# EAGLE design Scoreboard Module 20150702 (EAGLE 6.6.0)
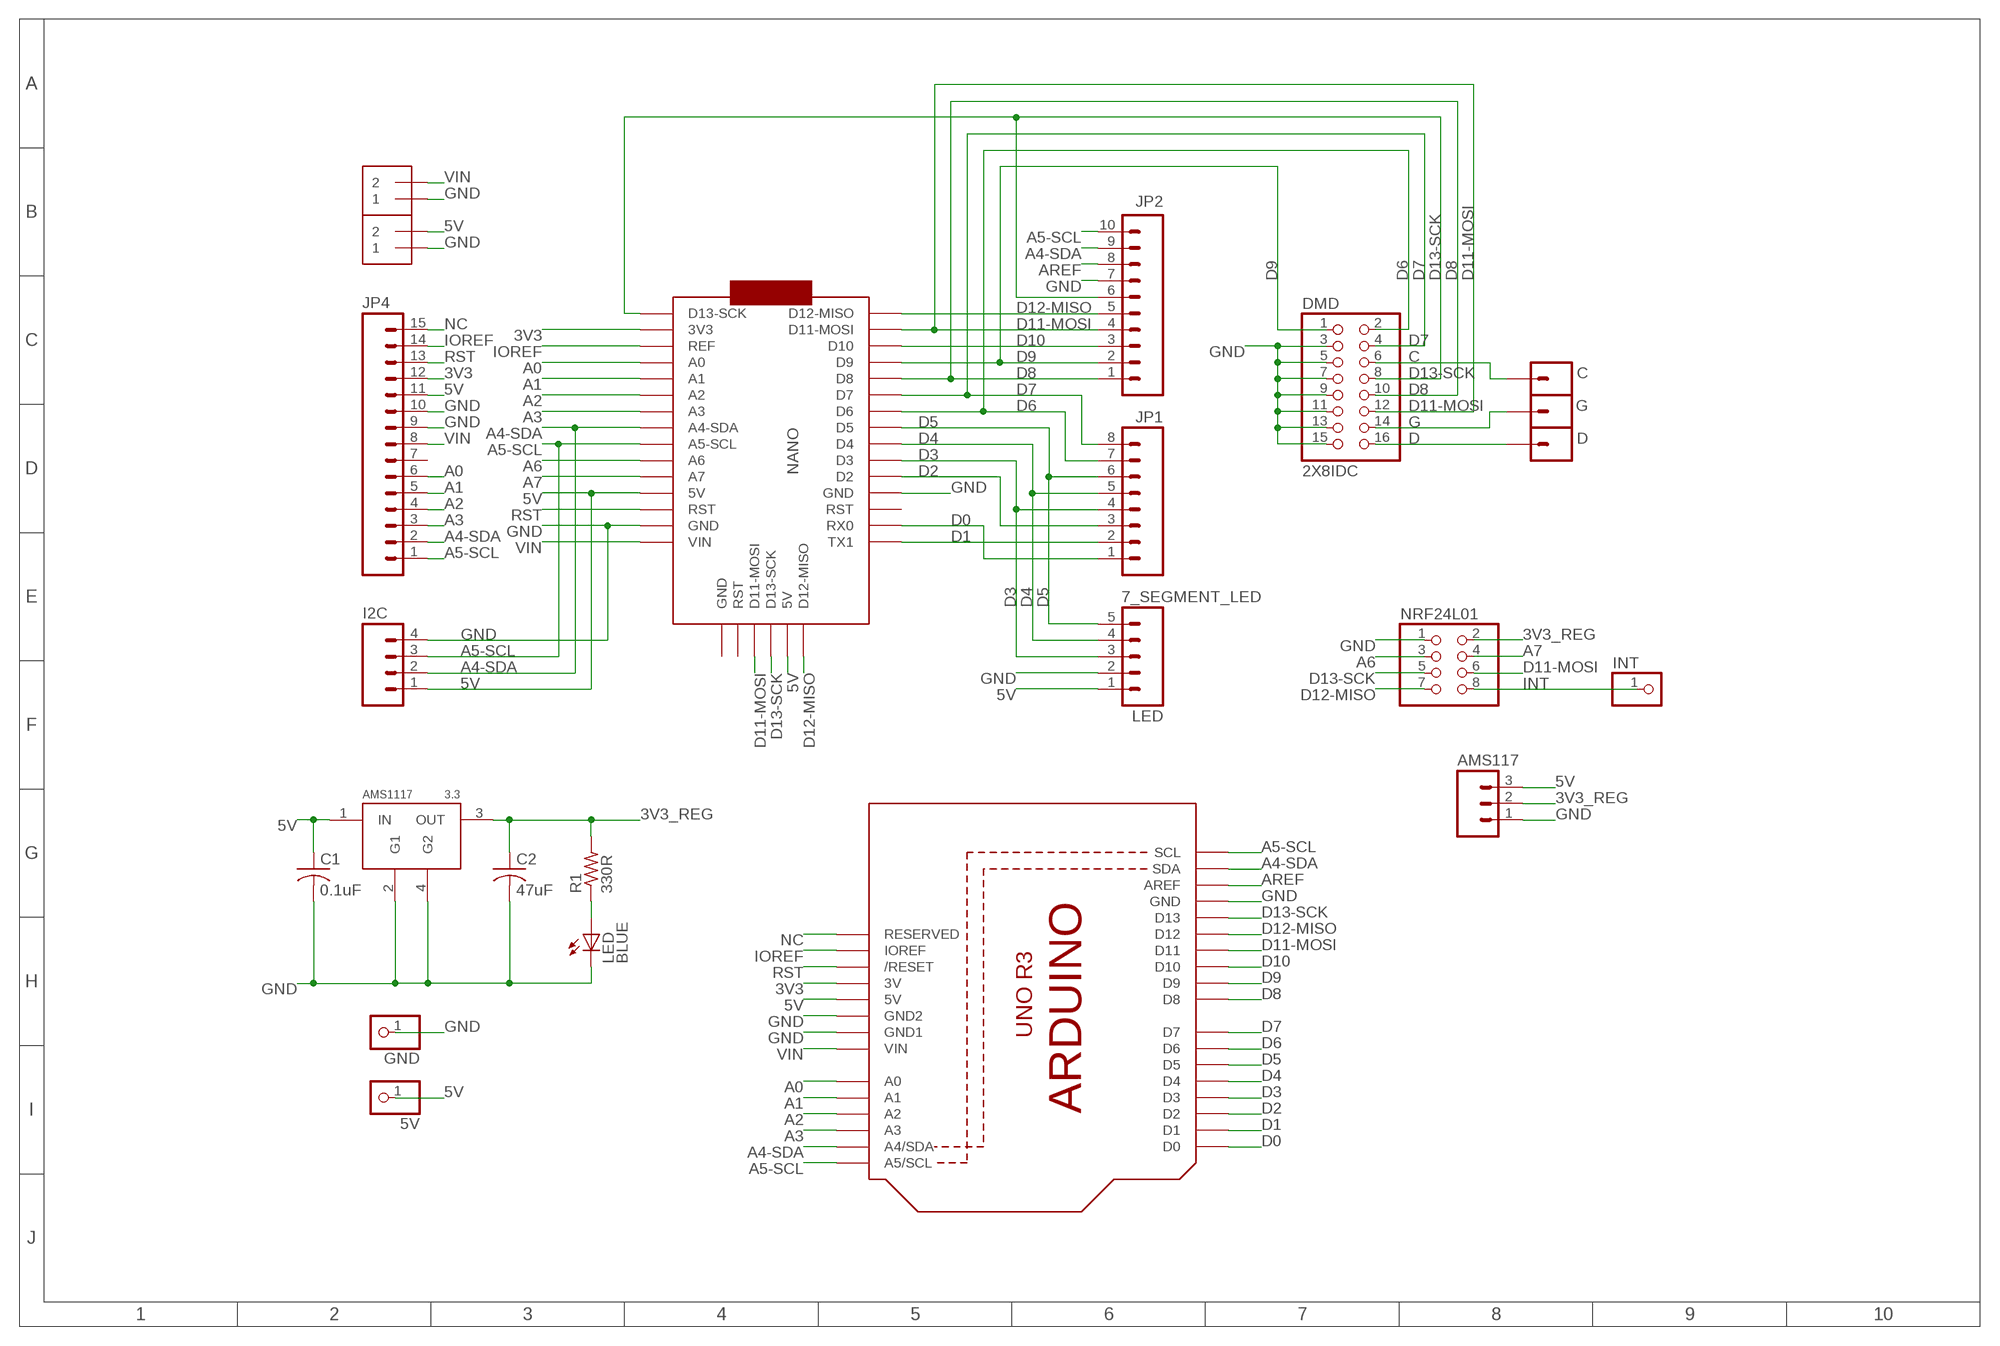
[diagram p0: schematic, sheet 1]

## Parts
5V  PINHD-1X1  [1X01]
7_SEGMENT_LED  LED  M05PTH  [1X05]
AMS117  M03PTH  [1X03]
AMS1117  3.3  VREG-SOT223  [SOT223]
C  M01PTH  [1X01]
C1  0.1uF  C-US050-035X075  [C050-035X075]
C2  47uF  C-US050-035X075  [C050-035X075]
D  M01PTH  [1X01]
DMD  2X8IDC  [2X08-IDC]
G  M01PTH  [1X01]
GND  PINHD-1X1  [1X01]
I2C  M04PTH  [1X04]
INT  PINHD-1X1  [1X01]
J1  1X2-3.5MM  [1X2-3.5MM]
J2  1X2-3.5MM  [1X2-3.5MM]
JP1  M08SILK_FEMALE_PTH  [1X08]
JP2  M10SILK_FEMALE_PTH  [1X10]
JP4  M15  [1X15]
LED  BLUE  LED3MM  [LED3MM]
NANO  ARDUINO_NANOICSP  [ARDUINO_NANO]
NRF24L01  PINHD-2X4  [2X04]
R1  330R  R-US_0204/7  [0204/7]
U2  ARDUINOR3-MOVEDTEXT  [ARDUINOR3-MOVEDTEXT]

## Nets
3V3 [power]: JP4.12 NANO.P$17(3V3) U2.3V
3V3_REG [power]: AMS117.2 AMS1117.3(OUT) C2.1 NRF24L01.2 R1.2
5V [power]: 5V.1 7_SEGMENT_LED.1 AMS117.3 AMS1117.1(IN) C1.1 I2C.1 J1.2 JP4.11 NANO.ICSP$2(5V) NANO.P$27(5V) U2.5V
A0: JP4.6 NANO.P$19(A0) U2.A0
A1: JP4.5 NANO.P$20(A1) U2.A1
A2: JP4.4 NANO.P$21(A2) U2.A2
A3: JP4.3 NANO.P$22(A3) U2.A3
A4-SDA: I2C.2 JP2.9 JP4.2 NANO.P$23(A4-SDA) U2.A4(A4/SDA) U2.SDA
A5-SCL: I2C.3 JP2.10 JP4.1 NANO.P$24(A5-SCL) U2.A5(A5/SCL) U2.SCL
A6: NANO.P$25(A6) NRF24L01.3
A7: NANO.P$26(A7) NRF24L01.4
AREF: JP2.8 U2.AREF
C: C.1 DMD.6
D: D.1 DMD.16
D0: JP1.1 NANO.P$2(RX0) U2.D0
D1: JP1.2 NANO.P$1(TX1) U2.D1
D2: JP1.3 NANO.P$5(D2) U2.D2
D3: 7_SEGMENT_LED.3 JP1.4 NANO.P$6(D3) U2.D3
D4: 7_SEGMENT_LED.4 JP1.5 NANO.P$7(D4) U2.D4
D5: 7_SEGMENT_LED.5 JP1.6 NANO.P$8(D5) U2.D5
D6: DMD.2 JP1.7 NANO.P$9(D6) U2.D6
D7: DMD.4 JP1.8 NANO.P$10(D7) U2.D7
D8: DMD.10 JP2.1 NANO.P$11(D8) U2.D8
D9: DMD.1 JP2.2 NANO.P$12(D9) U2.D9
D10: JP2.3 NANO.P$13(D10) U2.D10
D11-MOSI: DMD.12 JP2.4 NANO.ICSP$4(D11-MOSI) NANO.P$14(D11-MOSI) NRF24L01.6 U2.D11
D12-MISO: JP2.5 NANO.ICSP$1(D12-MISO) NANO.P$15(D12-MISO) NRF24L01.7 U2.D12
D13-SCK: DMD.8 JP2.6 NANO.ICSP$3(D13-SCK) NANO.P$16(D13-SCK) NRF24L01.5 U2.D13
G: DMD.14 G.1
GND [power]: 7_SEGMENT_LED.2 AMS117.1 AMS1117.2(G1) AMS1117.4(G2) C1.2 C2.2 DMD.3 DMD.5 DMD.7 DMD.9 DMD.11 DMD.13 DMD.15 GND.1 I2C.4 J1.1 J2.1 JP2.7 JP4.9 JP4.10 LED.K(C) NANO.P$4(GND) NANO.P$29(GND) NRF24L01.1 U2.GND U2.GND1 U2.GND2
INT: INT.1 NRF24L01.8
IOREF: JP4.14 NANO.P$18(REF) U2.IOREF
LED: LED.A R1.1
NC: JP4.15 U2.RESERVED
RST: JP4.13 NANO.P$28(RST) U2.RESET(/RESET)
VIN [power]: J2.2 JP4.8 NANO.P$30(VIN) U2.VIN
Unconnected: JP4.7 NANO.ICSP$5(RST) NANO.ICSP$6(GND) NANO.P$3(RST)

## Library data of the parts
5V GND INT = adafruit:PINHD-1X1: Pin header 1x1 for 0.1" spacing With round pins
7_SEGMENT_LED = SparkFun-Connectors:M05: Header 5 Standard 5-pin 0.1" header. Use with straight break away headers (SKU : PRT-00116), right angle break away headers (PRT-00553), swiss pins (PRT-00743), machine pins (PRT-00117), and female headers (PRT-00115). Molex polarized connector foot print use with SKU : PRT-08230 with associated crimp pins and housings.
AMS117 = SparkFun-Connectors:M03: Header 3 Standard 3-pin 0.1" header. Use with straight break away headers (SKU : PRT-00116), right angle break away headers (PRT-00553), swiss pins (PRT-00743), machine pins (PRT-00117), and female headers (PRT-00115). Molex polarized connector foot print use with SKU : PRT-08232 with associated crimp pins and housings.
AMS1117 = jt-vreg:VREG-SOT223: SOT223 voltage regulator
C D G = SparkFun-Connectors:M01: Header 1 Standard 1-pin 0.1" header. Use with straight break away headers (SKU : PRT-00116), right angle break away headers (PRT-00553), swiss pins (PRT-00743), machine pins (PRT-00117), and female headers (PRT-00115).
C1 C2 = adafruit:C-US: CAPACITOR, American symbol
DMD = adafruit:2X8
I2C = SparkFun-Connectors:M04: Header 4 Standard 4-pin 0.1" header. Use with straight break away headers (SKU : PRT-00116), right angle break away headers (PRT-00553), swiss pins (PRT-00743), machine pins (PRT-00117), and female headers (PRT-00115). Molex polarized connector foot print use with SKU : PRT-08231 with associated crimp pins and housings. 1MM SMD Version SKU: PRT-10208
J1 J2 = adafruit:1X2: 3.5mm Terminal block http://www.ladyada.net/library/pcb/eaglelibrary.html
JP1 = SparkFun-Connectors:M08: Header 8 Standard 8-pin 0.1" header. Use with straight break away headers (SKU : PRT-00116), right angle break away headers (PRT-00553), swiss pins (PRT-00743), machine pins (PRT-00117), and female headers (PRT-00115).; PROD_ID: CONN-08438
JP2 = SparkFun-Connectors:M10: Header 10 Standard 10-pin 0.1" header. Use with straight break away headers (SKU : PRT-00116), right angle break away headers (PRT-00553), swiss pins (PRT-00743), machine pins (PRT-00117), and female headers (PRT-00115).; PROD_ID: CONN-11563
JP4 = SparkFun-Connectors:M15: Header 15 Standard 15-pin 0.1" header. Use with straight break away headers (SKU : PRT-00116), right angle break away headers (PRT-00553), swiss pins (PRT-00743), machine pins (PRT-00117), and female headers (PRT-00115).
LED = adafruit:LED: LED OSRAM: - CHIPLED LG R971, LG N971, LY N971, LG Q971, LY Q971, LO R971, LY R971 LH N974, LH R974 LS Q976, LO Q976, LY Q976 LO Q996 - Hyper CHIPLED LW Q18S LB Q993, LB Q99A, LB R99A - SideLED LS A670, LO A670, LY A670, LG A670, LP A670 LB A673, LV A673, LT A673, LW A673 LH A674 LY A675 LS A676, LA A676, LO A676, LY A676, LW A676 LS A679, LY A679, LG A679 - Hyper Micro SIDELED® LS Y876, LA Y876, LO Y876, LY Y876 LT Y87S - SmartLED LW L88C, LW L88S LB L89C, LB L89S, LG L890 LS L89K, LO L89K, LY L89K LS L896, LA L896, LO L896, LY L896 - TOPLED LS T670, LO T670, LY T670, LG T670, LP T670 LSG T670, LSP T670, LSY T670, LOP T670, LYG T670 LG T671, LOG T671, LSG T671 LB T673, LV T673, LT T673, LW T673 LH T674 LS T676, LA T676, LO T676, LY T676, LB T676, LH T676, LSB T676, LW T676 LB T67C, LV T67C, LT T67C, LS T67K, LO T67K, LY T67K, LW E67C LS E67B, LA E67B, LO E67B, LY E67B, LB E67C, LV E67C, LT E67C LW T67C LS T679, LY T679, LG T679 LS T770, LO T770, LY T770, LG T770, LP T770 LB T773, LV T773, LT T773, LW T773 LH T774 LS E675, LA E675, LY E675, LS T675 LS T776, LA T776, LO T776, LY T776, LB T776 LHGB T686 LT T68C, LB T68C - Hyper Mini TOPLED® LB M676 - Mini TOPLED Santana® LG M470 LS M47K, LO M47K, LY M47K Source: http://www.osram.convergy.de/
NANO = Custom Parts:ARDUINO_NANO
NRF24L01 = adafruit:PINHD-2X4: PIN HEADER
R1 = adafruit:R-US_: RESISTOR, American symbol
U2 = adafruit:ARDUINOR3: This is a new object for the new Arduino R3 - with extra pins that you may want to use (such as IOref, and duplicated A4/A5

## Net classes
0 default: width 0.203 mm, clearance 0.203 mm
1 power: width 0.305 mm, clearance 0.203 mm
2 signal: width 0.203 mm, clearance 0.203 mm

## Board
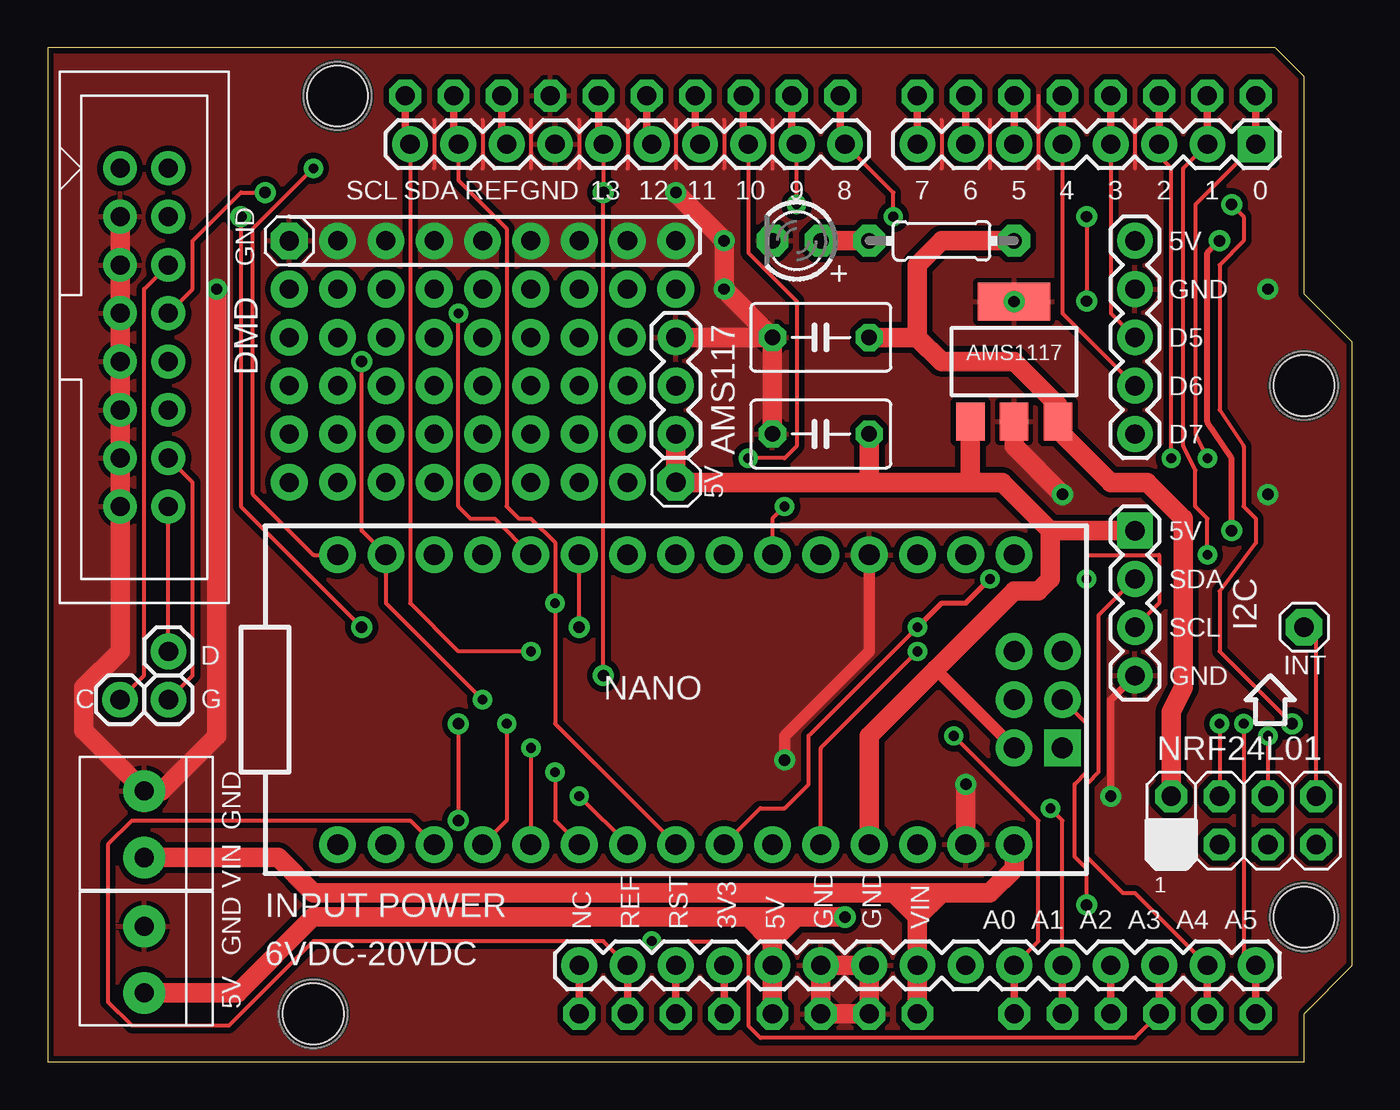
[diagram p1: board, top side]
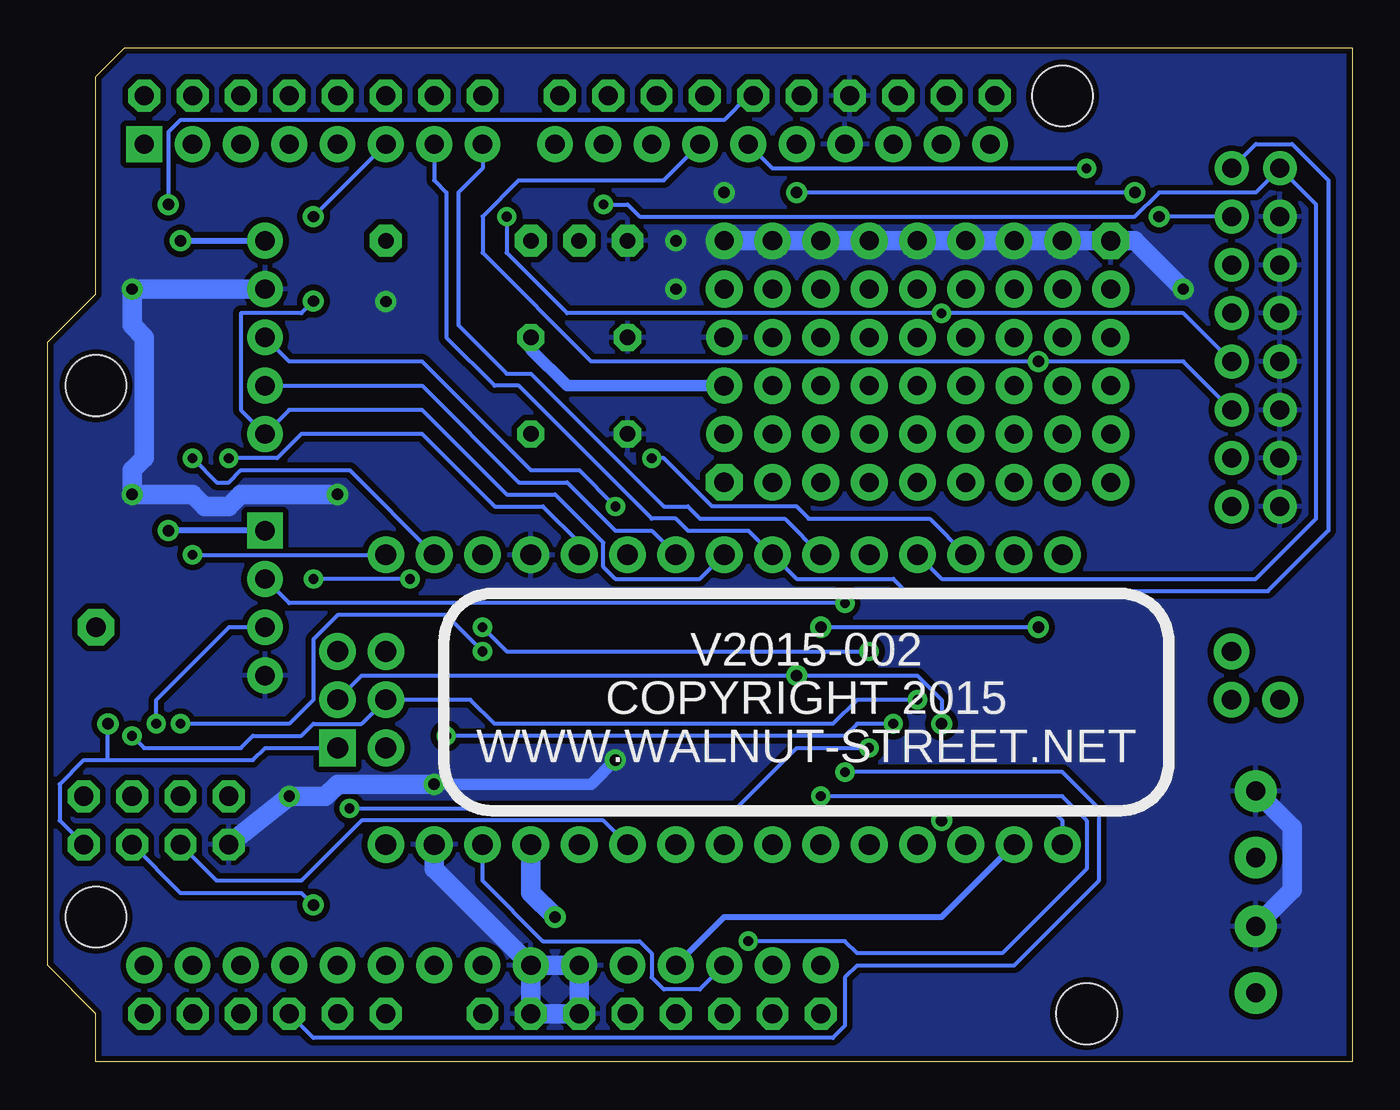
[diagram p2: board, bottom side, seen from below]

Size 68.58 x 53.34 mm. Coordinates in mm from the lower left corner, seen from the top.
Copper layers (1*16): Top 0.035mm / dielectric 1.5mm / Bottom 0.035mm
Design rules "SparkFun": minimum track width 8mil, minimum drill 20mil, track to track 8mil, track to pad 8mil, pad to pad 8mil, via to via 8mil, smd to smd 8mil, copper to edge 10mil, drill to drill 8mil, minimum pad ring 12mil, minimum via ring 10mil, stop-mask expansion 4mil, vias tented up to drill 25mil, thermal gap 10mil
Holes 3.2 mm at 15.24,50.8 66.04,35.56 66.04,7.62 13.97,2.54

### Footprints (pad centres in the part's own frame; a part is rotated, then mirrored left to right if it is on the bottom)
1X01 = drill 1.016 pad 1.93 octagon: 1 0,0
1X05 = drill 1.016 pad 1.88: 1 0,0; 2 2.54,0; 3 5.08,0; 4 7.62,0; 5 10.16,0
1X03 = drill 1.016 pad 1.88: 1 0,0; 2 2.54,0; 3 5.08,0
SOT223 = smd 1.5 x 2: 1 -2.3,-3.15; 2 0,-3.15; 3 2.3,-3.15 | smd 3.8 x 2: 4 0,3.15
1X01' = drill 1.016 pad 1.88: 1 0,0
C050-035X075 = drill 0.813 octagon: 1 -2.54,0; 2 2.54,0
2X08-IDC = drill 1 pad 1.778: 1 -1.27,8.89; 2 1.27,8.89; 3 -1.27,6.35; 4 1.27,6.35; 5 -1.27,3.81; 6 1.27,3.81; 7 -1.27,1.27; 8 1.27,1.27; 9 -1.27,-1.27; 10 1.27,-1.27; 11 -1.27,-3.81; 12 1.27,-3.81; 13 -1.27,-6.35; 14 1.27,-6.35; 15 -1.27,-8.89; 16 1.27,-8.89
1X04 = drill 1.016 pad 1.88 square: 1 0,0 | drill 1.016 pad 1.88: 2 2.54,0; 3 5.08,0; 4 7.62,0
1X2-3.5MM = drill 1 pad 2.184: 1 1.8,0; 2 -1.7,0
1X08 = drill 1.016 pad 1.88 square: 1 0,0 | drill 1.016 pad 1.88: 2 2.54,0; 3 5.08,0; 4 7.62,0; 5 10.16,0; 6 12.7,0; 7 15.24,0; 8 17.78,0
1X10 = drill 1.016 pad 1.88: 1 0,0; 2 2.54,0; 3 5.08,0; 4 7.62,0; 5 10.16,0; 6 12.7,0; 7 15.24,0; 8 17.78,0; 9 20.32,0; 10 22.86,0
1X15 = drill 1.016 pad 1.88: 1 0,0; 2 2.54,0; 3 5.08,0; 4 7.62,0; 5 10.16,0; 6 12.7,0; 7 15.24,0; 8 17.78,0; 9 20.32,0; 10 22.86,0; 11 25.4,0; 12 27.94,0; 13 30.48,0; 14 33.02,0; 15 35.56,0
LED3MM = drill 0.813 pad 1.676 octagon: A -1.27,0; K 1.27,0
ARDUINO_NANO = drill 1.1 pad 1.93 square: ICSP$1 20.32,-2.54 | drill 1.1 pad 1.93: ICSP$2 17.78,-2.54; ICSP$3 20.32,0; ICSP$4 17.78,0; ICSP$5 20.32,2.54; ICSP$6 17.78,2.54; P$1 17.78,7.62; P$2 15.24,7.62; P$3 12.7,7.62; P$4 10.16,7.62; P$5 7.62,7.62; P$6 5.08,7.62; P$7 2.54,7.62; P$8 0,7.62; P$9 -2.54,7.62; P$10 -5.08,7.62; P$11 -7.62,7.62; P$12 -10.16,7.62; P$13 -12.7,7.62; P$14 -15.24,7.62; P$15 -17.78,7.62; P$16 -17.78,-7.62; P$17 -15.24,-7.62; P$18 -12.7,-7.62; P$19 -10.16,-7.62; P$20 -7.62,-7.62; P$21 -5.08,-7.62; P$22 -2.54,-7.62; P$23 0,-7.62; P$24 2.54,-7.62; P$25 5.08,-7.62; P$26 7.62,-7.62; P$27 10.16,-7.62; P$28 12.7,-7.62; P$29 15.24,-7.62; P$30 17.78,-7.62
2X04 = drill 1.016 pad 1.676 octagon: 1 -3.81,-1.27; 2 -3.81,1.27; 3 -1.27,-1.27; 4 -1.27,1.27; 5 1.27,-1.27; 6 1.27,1.27; 7 3.81,-1.27; 8 3.81,1.27
0204/7 = drill 0.813 pad 1.676 octagon: 1 -3.81,0; 2 3.81,0
ARDUINOR3-MOVEDTEXT = drill 1 pad 1.676 octagon: 3V 35.56,2.54; 5V 38.1,2.54; A0 50.8,2.54; A1 53.34,2.54; A2 55.88,2.54; A3 58.42,2.54; A4 60.96,2.54; A5 63.5,2.54; AREF 23.876,50.8; D0 63.5,50.8; D1 60.96,50.8; D2 58.42,50.8; D3 55.88,50.8; D4 53.34,50.8; D5 50.8,50.8; D6 48.26,50.8; D7 45.72,50.8; D8 41.656,50.8; D9 39.116,50.8; D10 36.576,50.8; D11 34.036,50.8; D12 31.496,50.8; D13 28.956,50.8; GND 26.416,50.8; GND1 43.18,2.54; GND2 40.64,2.54; IOREF 30.48,2.54; RESERVED 27.94,2.54; RESET 33.02,2.54; SCL 18.796,50.8; SDA 21.336,50.8; VIN 45.72,2.54

### Placement (x,y rotation side)
5V  33.02,30.48 0 top
7_SEGMENT_LED  57.15,43.18 270 top
AMS117  33.02,38.1 270 top
AMS1117  50.8,36.83 0 top
C  M01PTH  [1X01']  3.81,19.05 0 top
C1  40.64,33.02 180 top
C2  40.64,38.1 180 top
D  M01PTH  [1X01']  6.35,21.59 0 top
DMD  5.08,38.1 0 top
G  M01PTH  [1X01']  6.35,19.05 0 top
GND  12.7,43.18 0 top
I2C  57.15,27.94 270 top
INT  66.04,22.86 0 top
J1  5.08,5.33 90 top
J2  5.08,12.45 90 top
JP1  63.5,48.26 180 top
JP2  41.91,48.26 180 top
JP4  63.5,5.08 180 top
LED  39.37,43.18 180 top
NANO  33.02,19.05 0 top
NRF24L01  62.87,12.7 0 top
R1  46.99,43.18 0 top
U2  0,0 0 top

### Tracks (layer width: path | path; a pad name or v marks a point on that pad's centre or on a via)
3V3
  Top 0.406: U2.3V JP4.12
  Bottom 0.305: NANO.P$17 21.59,7.62 33.02,7.62 JP4.12
3V3_REG
  Top 1.016: 45.72,38.1 46.99,36.83 50.8,36.83 53.1,34.53 AMS1117.3 53.1,33.26 55.88,30.48 57.78,30.48 59.69,28.57 59.69,19.68 59.05,18.41 NRF24L01.2 | 45.72,38.1 C2.1 | 45.72,38.1 45.72,41.91 46.99,43.18 R1.2
  Bottom 0.61: AMS117.2 41.27,35.56 43.18,37.47 C2.1
5V  (via drill 0.6)
  Top 0.305: v62.23,27.94 62.23,31.75 60.96,33.66 60.96,42.55 v61.59,43.18
  Top 0.61: 46.67,20.64 NANO.ICSP$2
  Top 1.016: J1.2 9.98,3.63 13.97,7.62 36.83,7.62 | 36.83,7.62 38.1,6.35 | 38.1,6.35 JP4.11 U2.5V | 36.83,7.62 39.37,7.62 | 38.1,6.35 39.37,7.62 | 39.37,7.62 v41.91,7.62 | NANO.P$27 43.18,17.14 46.67,20.64 50.8,24.77 52.07,24.77 52.7,25.4 52.7,27.94 | 48.26,30.48 50.16,30.48 52.7,27.94 | 48.26,30.48 43.18,30.48 | 43.18,30.48 5V.1 AMS117.3 | C1.1 43.18,30.48 | AMS1117.1 48.5,30.72 48.26,30.48 | I2C.1 52.7,27.94
  Bottom 0.305: v61.59,43.18 7_SEGMENT_LED.1 | I2C.1 v62.23,27.94
  Bottom 1.016: v41.91,7.62 43.18,8.89 NANO.P$27
A0  (via drill 0.51)
  Top 0.203: NANO.P$19 24.13,12.7 v24.13,17.78 | JP4.6 52.07,6.35 52.07,12.7 v47.62,17.14
  Top 0.406: U2.A0 JP4.6
  Bottom 0.203: v24.13,17.78 26.04,17.78 26.67,17.14 v47.62,17.14
A1  (via drill 0.51)
  Top 0.203: v25.4,16.51 NANO.P$20 | v52.7,13.34 53.34,12.7 JP4.5
  Top 0.406: U2.A1 JP4.5
  Bottom 0.203: v25.4,16.51 29.21,16.51 32.38,13.34 v52.7,13.34
A2  (via drill 0.51)
  Top 0.203: NANO.P$21 26.67,12.7 v26.67,15.24
  Top 0.406: U2.A2 JP4.4
  Bottom 0.203: v26.67,15.24 15.24,15.24 13.34,13.34 13.34,9.53 17.78,5.08 26.04,5.08 26.67,4.45 26.67,1.91 27.3,1.27 54.61,1.27 U2.A2
A3  (via drill 0.51)
  Top 0.203: v27.94,13.97 NANO.P$22 | U2.A3 57.15,1.27 37.47,1.27 36.83,1.91 36.83,5.71 36.2,6.35 v31.75,6.35
  Top 0.406: U2.A3 JP4.3
  Bottom 0.203: v27.94,13.97 15.24,13.97 13.97,12.7 13.97,10.16 18.41,5.71 26.04,5.71 26.67,6.35 v31.75,6.35
A4-SDA  (via drill 0.51)
  Top 0.203: I2C.2 55.24,23.5 55.24,15.24 54.61,14.61 54.61,10.79 56.52,8.89 57.15,8.89 JP4.2 | NANO.P$23 26.67,17.78 v26.67,24.13 26.67,27.3 25.4,28.57 24.77,28.57 24.13,29.21 24.13,43.81 21.59,46.35 JP2.9
  Top 0.406: U2.SDA 21.34,48.51 JP2.9 | U2.A4 JP4.2
  Bottom 0.203: I2C.2 55.88,24.13 v26.67,24.13
A5-SCL  (via drill 0.51)
  Top 0.203: NANO.P$24 37.47,13.34 38.73,13.34 40.01,14.61 40.01,17.14 v45.72,22.86 | JP4.1 62.87,5.71 v62.87,17.78 | JP2.10 19.05,24.13 21.59,21.59 v25.4,21.59 | I2C.3 58.42,24.13 58.42,26.67 54.61,26.67 v54.61,25.4
  Top 0.254: v45.72,22.86 46.99,24.13 48.26,24.13 v49.53,25.4
  Top 0.406: U2.SCL 18.8,48.51 JP2.10 | U2.A5 JP4.1
  Bottom 0.203: I2C.3 59.05,22.86 62.87,19.05 v62.87,17.78 | v25.4,21.59 44.45,21.59 v45.72,22.86 | v49.53,25.4 v54.61,25.4
A6
  Bottom 0.203: NANO.P$25 39.37,12.7 52.07,12.7 55.24,9.53 59.69,9.53 NRF24L01.3
A7  (via drill 0.51)
  Top 0.203: v61.59,17.78 NRF24L01.4 | v45.72,21.59 40.64,16.51 NANO.P$26
  Bottom 0.203: v45.72,21.59 47.62,23.5 53.34,23.5 54.61,22.23 54.61,19.05 55.88,17.78 v61.59,17.78
AREF
  Top 0.406: U2.AREF 23.88,48.51 JP2.8
C
  Top 0.203: DMD.6 5.08,40.64 5.08,20.32 C.1
D
  Top 0.203: D.1 DMD.16
D0  (via drill 0.51)
  Top 0.203: JP1.1 60.33,45.09 60.33,33.02 v60.96,31.75
  Top 0.406: U2.D0 JP1.1
  Bottom 0.203: NANO.P$2 52.7,31.11 58.42,31.11 59.05,30.48 59.69,30.48 v60.96,31.75
D1  (via drill 0.51)
  Top 0.203: JP1.2 59.69,46.99 59.69,32.38 60.33,31.11 60.33,29.21 60.96,28.57 v60.96,26.67
  Top 0.406: U2.D1 JP1.2
  Bottom 0.203: v60.96,26.67 NANO.P$1
D2  (via drill 0.51)
  Top 0.203: v59.05,31.75 59.05,46.99 58.42,47.62 JP1.3
  Top 0.406: U2.D2 JP1.3
  Bottom 0.203: NANO.P$5 40.64,27.3 42.55,29.21 45.09,29.21 48.9,33.02 55.24,33.02 56.52,31.75 v59.05,31.75
D3  (via drill 0.51)
  Top 0.203: 7_SEGMENT_LED.3 55.88,39.37 JP1.4 | v38.73,29.21 38.1,28.57 NANO.P$6
  Top 0.406: U2.D3 JP1.4
  Bottom 0.203: v38.73,29.21 40.64,31.11 43.18,31.11 48.9,36.83 55.88,36.83 7_SEGMENT_LED.3
D4
  Top 0.203: 7_SEGMENT_LED.4 53.34,39.37 JP1.5
  Top 0.406: U2.D4 JP1.5
  Bottom 0.203: NANO.P$7 36.83,27.94 38.73,27.94 41.27,30.48 43.81,30.48 48.9,35.56 7_SEGMENT_LED.4
D5  (via drill 0.6)
  Top 0.203: v54.61,44.45 v54.61,40.01
  Top 0.406: U2.D5 JP1.6
  Bottom 0.203: NANO.P$8 34.29,25.4 38.73,25.4 39.37,26.04 39.37,27.3 41.91,29.84 44.45,29.84 48.9,34.29 55.88,34.29 7_SEGMENT_LED.5 58.42,34.29 58.42,39.37 55.24,39.37 v54.61,40.01 | JP1.6 v54.61,44.45
D6
  Top 0.406: U2.D6 JP1.7
  Bottom 0.203: DMD.2 5.08,48.26 3.17,48.26 1.27,46.35 1.27,27.94 4.45,24.77 23.5,24.77 24.13,25.4 29.21,25.4 NANO.P$9 31.75,27.94 34.92,27.94 35.56,28.57 36.83,28.57 43.81,35.56 45.09,35.56 47.62,38.1 47.62,45.72 48.26,46.35 JP1.7
D7  (via drill 0.6 pad 1.02)
  Top 0.203: v10.16,44.45 10.16,29.21 v16.51,22.86 | v27.94,22.86 NANO.P$10
  Top 0.406: U2.D7 JP1.8
  Bottom 0.203: JP1.8 45.72,46.99 46.99,45.72 46.99,38.73 44.45,36.2 43.18,36.2 36.2,29.21 34.92,29.21 34.29,28.57 29.84,28.57 NANO.P$10 | DMD.4 v10.16,44.45 | v16.51,22.86 v27.94,22.86
D8  (via drill 0.51)
  Top 0.203: v21.59,39.37 21.59,29.21 22.23,28.57 23.5,28.57 NANO.P$11 | JP2.1 44.45,45.72 v44.45,44.45
  Top 0.406: U2.D8 41.66,48.51 JP2.1
  Bottom 0.203: DMD.10 8.89,39.37 v21.59,39.37 41.27,39.37 44.45,42.55 v44.45,44.45
D9  (via drill 0.51)
  Top 0.203: v39.37,45.09 JP2.2
  Top 0.406: U2.D9 39.12,48.51 JP2.2
  Bottom 0.203: NANO.P$12 21.59,25.4 5.08,25.4 1.91,28.57 1.91,45.09 DMD.1 5.08,45.72 10.16,45.72 11.43,44.45 37.47,44.45 38.1,45.09 v39.37,45.09
D10  (via drill 0.51)
  Top 0.203: JP2.3 36.83,42.55 39.37,40.01 39.37,32.38 38.73,31.75 v36.83,31.75
  Top 0.406: U2.D10 36.58,48.51 JP2.3
  Bottom 0.203: NANO.P$13 22.23,28.57 28.57,28.57 29.21,29.21 33.66,29.21 36.2,31.75 v36.83,31.75
D11-MOSI  (via drill 0.51, 0.6)
  Top 0.203: v64.14,17.14 NRF24L01.6 | v22.86,19.05 17.78,24.13 NANO.P$14 16.51,27.94 v16.51,36.83
  Top 0.406: U2.D11 34.04,48.51 JP2.4
  Bottom 0.203: DMD.12 8.89,36.83 v16.51,36.83 40.01,36.83 45.72,42.55 45.72,44.45 43.81,46.35 36.2,46.35 JP2.4 | v22.86,19.05 26.04,19.05 27.3,17.78 45.09,17.78 46.35,19.05 NANO.ICSP$4 52.07,17.78 54.61,17.78 55.24,17.14 57.78,17.14 58.42,16.51 63.5,16.51 v64.14,17.14
D12-MISO  (via drill 0.51, 0.6)
  Top 0.203: NANO.P$15 13.97,26.67 10.79,29.84 10.79,43.81 v13.97,46.99 | v62.23,45.09 62.87,44.45 62.87,43.18 61.59,41.91 61.59,34.29 62.87,32.38 62.87,29.21 63.5,28.57 63.5,27.3 61.59,24.77 61.59,21.59 v65.41,17.78
  Top 0.406: U2.D12 31.5,48.51 JP2.5
  Bottom 0.203: v13.97,46.99 30.48,46.99 JP2.5 | NRF24L01.7 67.94,12.7 67.94,14.61 66.67,15.88 65.41,15.88 | U2.D12 31.75,50.8 33.02,49.53 61.59,49.53 62.23,48.9 v62.23,45.09 | 65.41,15.88 v65.41,17.78 | 65.41,15.88 57.78,15.88 57.15,16.51 NANO.ICSP$1
D13-SCK  (via drill 0.6)
  Top 0.203: JP2.6 v29.21,45.72 v29.21,20.32 | v21.59,17.78 v21.59,12.7 | NANO.ICSP$3 54.61,17.78 54.61,15.24 53.98,14.61 53.98,10.79 54.61,10.16 v54.61,8.26 | DMD.8 7.62,40.64 7.62,43.18 10.16,45.72 v11.43,45.72
  Top 0.406: U2.D13 28.96,48.51 JP2.6
  Bottom 0.203: v21.59,17.78 21.59,19.05 22.86,20.32 v29.21,20.32 52.07,20.32 NANO.ICSP$3 | v21.59,12.7 20.95,13.34 15.88,13.34 15.24,12.7 NANO.P$16 | v11.43,45.72 v29.21,45.72 | NRF24L01.5 61.59,8.89 55.24,8.89 v54.61,8.26
G
  Top 0.203: DMD.14 7.62,30.48 7.62,20.32 G.1
GND  (via drill 0.6, 0.6 pad 1.02, 1 pad 1.93)
  Top 0.203: 38.1,49.53 38.1,46.99 | 46.99,49.53 46.99,46.99 | 49.53,49.53 49.53,46.99 | 57.15,49.53 57.15,46.99 | 30.48,49.53 30.48,46.99 | 27.94,49.53 27.94,46.99 | 33.02,49.53 33.02,46.99 | 35.56,49.53 35.56,46.99 | 20.32,49.53 20.32,46.99 | 22.86,49.53 22.86,46.99 | 25.4,49.53 25.4,46.99 | 52.07,50.8 52.07,46.99
  Top 0.406: v55.88,13.97 55.88,19.05 I2C.4
  Top 0.61: NANO.P$4 43.18,21.59 38.73,17.14 v38.73,15.88
  Top 1.016: AMS1117.4 50.83,40.01 52.07,40.01 | C2.2 C1.2 | C2.2 v35.56,40.64 v35.56,43.18 v33.02,45.72 | v8.89,40.64 8.89,17.14 5.99,14.25 J2.1 1.91,17.42 1.91,19.68 3.81,21.59 DMD.15 DMD.13 DMD.11 DMD.9 DMD.7 DMD.5 DMD.3 | NANO.P$29 v48.26,14.61 | v53.34,29.84 50.8,32.38 AMS1117.2 | AMS117.1 C2.2 | U2.GND2 JP4.10 JP4.9 U2.GND1 U2.GND2
  Bottom 0.61: v38.73,15.88 40.01,14.61 v48.26,14.61
  Bottom 1.016: JP4.9 JP4.10 U2.GND2 U2.GND1 JP4.9 | v33.02,43.18 v30.48,43.18 v27.94,43.18 v25.4,43.18 v22.86,43.18 v20.32,43.18 v17.78,43.18 v15.24,43.18 GND.1 11.43,43.18 v8.89,40.64 | JP4.9 48.26,10.16 NANO.P$29 | NRF24L01.1 v55.88,13.97 53.98,13.97 53.34,14.61 v48.26,14.61 | 7_SEGMENT_LED.2 v64.14,40.64 64.14,38.73 63.5,38.1 63.5,31.75 64.14,31.11 v64.14,29.84 60.96,29.84 60.33,29.21 59.05,29.21 58.42,29.84 v53.34,29.84 | J2.1 3.17,12.34 3.17,9.04 J1.1
  other vias: 50.8,39.98
  pour Bottom (isolate 0.305): 0,53.34 0,0 66.04,0 66.04,2.54 68.58,5.08 68.58,38.1 66.04,40.64 66.04,52.07 64.77,53.34
  pour Top (isolate 0.305): 0,0 0,53.34 64.77,53.34 66.04,52.07 66.04,40.64 68.58,38.1 68.58,5.08 66.04,2.54 66.04,0
INT
  Top 0.203: NRF24L01.8 66.67,22.23 INT.1
IOREF
  Top 0.203: NANO.P$18 19.05,12.7 4.45,12.7 3.17,11.43 3.17,3.17 4.45,1.91 9.53,1.91 13.97,6.35 29.21,6.35 JP4.14
  Top 0.406: U2.IOREF JP4.14
LED
  Top 1.016: R1.1 LED.A
N$1  (via drill 1 pad 1.93)
  other vias: 12.7,40.64
N$3  (via drill 1 pad 1.93)
  other vias: 15.24,33.02
N$4  (via drill 1 pad 1.93)
  other vias: 17.78,33.02
N$6  (via drill 1 pad 1.93)
  other vias: 20.32,33.02
N$8  (via drill 1 pad 1.93)
  other vias: 22.86,33.02
N$9  (via drill 1 pad 1.93)
  other vias: 25.4,33.02
N$10  (via drill 1 pad 1.93)
  other vias: 27.94,33.02
N$11  (via drill 1 pad 1.93)
  other vias: 27.94,35.56
N$12  (via drill 1 pad 1.93)
  other vias: 27.94,38.1
N$13  (via drill 1 pad 1.93)
  other vias: 27.94,40.64
N$18  (via drill 1 pad 1.93)
  other vias: 25.4,35.56
N$19  (via drill 1 pad 1.93)
  other vias: 22.86,35.56
N$20  (via drill 1 pad 1.93)
  other vias: 20.32,35.56
N$21  (via drill 1 pad 1.93)
  other vias: 17.78,35.56
N$22  (via drill 1 pad 1.93)
  other vias: 15.24,35.56
N$23  (via drill 1 pad 1.93)
  other vias: 12.7,38.1
N$24  (via drill 1 pad 1.93)
  other vias: 12.7,35.56
N$25  (via drill 1 pad 1.93)
  other vias: 12.7,33.02
N$26  (via drill 1 pad 1.93)
  other vias: 12.7,30.48
N$27  (via drill 1 pad 1.93)
  other vias: 15.24,40.64
N$28  (via drill 1 pad 1.93)
  other vias: 17.78,40.64
N$29  (via drill 1 pad 1.93)
  other vias: 20.32,40.64
N$30  (via drill 1 pad 1.93)
  other vias: 22.86,40.64
N$31  (via drill 1 pad 1.93)
  other vias: 25.4,40.64
N$33  (via drill 1 pad 1.93)
  other vias: 25.4,38.1
N$34  (via drill 1 pad 1.93)
  other vias: 22.86,38.1
N$35  (via drill 1 pad 1.93)
  other vias: 20.32,38.1
N$36  (via drill 1 pad 1.93)
  other vias: 17.78,38.1
N$37  (via drill 1 pad 1.93)
  other vias: 15.24,38.1
N$38  (via drill 1 pad 1.93)
  other vias: 15.24,30.48
N$40  (via drill 1 pad 1.93)
  other vias: 30.48,30.48
N$42  (via drill 1 pad 1.93)
  other vias: 30.48,33.02
N$43  (via drill 1 pad 1.93)
  other vias: 17.78,30.48
N$44  (via drill 1 pad 1.93)
  other vias: 20.32,30.48
N$45  (via drill 1 pad 1.93)
  other vias: 22.86,30.48
N$46  (via drill 1 pad 1.93)
  other vias: 25.4,30.48
N$47  (via drill 1 pad 1.93)
  other vias: 27.94,30.48
N$48  (via drill 1 pad 1.93)
  other vias: 30.48,35.56
N$49  (via drill 1 pad 1.93)
  other vias: 30.48,38.1
N$50  (via drill 1 pad 1.93)
  other vias: 30.48,40.64
N$56  (via drill 1 pad 1.93)
  other vias: 33.02,40.64
NC
  Top 0.406: U2.RESERVED JP4.15
RST
  Top 0.406: U2.RESET JP4.13
  Bottom 0.203: NANO.P$28 45.72,9.53 42.55,6.35 37.47,6.35 36.83,5.71 36.83,4.45 36.2,3.81 34.29,3.81 JP4.13
VIN
  Top 1.016: J2.2 12.11,10.75 13.97,8.89 44.45,8.89 | 44.45,8.89 45.72,8.89 | 45.72,8.89 46.99,8.89 | 46.99,8.89 49.53,8.89 50.8,10.16 NANO.P$30 | 45.72,8.89 45.72,7.62 | 45.72,7.62 JP4.8 U2.VIN | 44.45,8.89 45.72,7.62 | 45.72,7.62 46.99,8.89

### Text on the board
tPlace: 5V | GND | D5 | D6 | D7 | 5V | SDA | SCL | GND | GND | VIN | 1 | INPUT POWER | GND | 6VDC-20VDC | 5V
bPlace: V2015-002 | COPYRIGHT 2015 | WWW.WALNUT-STREET.NET